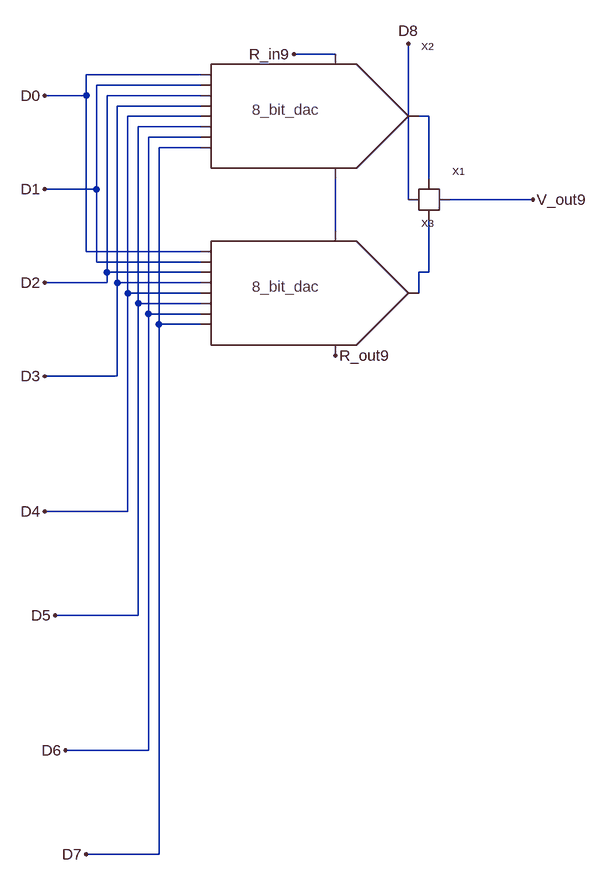
[diagram p0: schematic 9_bit_dac.asc]
9_bit_dac.asc, the LTspice schematic file:
Version 4
SHEET 1 880 1372
WIRE 96 80 32 80
WIRE -112 112 -288 112
WIRE -112 128 -272 128
WIRE -288 144 -288 112
WIRE -288 144 -352 144
WIRE -112 144 -256 144
WIRE -112 160 -240 160
WIRE -112 176 -224 176
WIRE 240 176 224 176
WIRE -112 192 -208 192
WIRE -112 208 -192 208
WIRE -112 224 -176 224
WIRE 240 272 240 176
WIRE -272 288 -272 128
WIRE -272 288 -352 288
WIRE 208 304 208 64
WIRE 400 304 272 304
WIRE 96 352 96 272
WIRE -288 384 -288 144
WIRE -112 384 -288 384
WIRE -272 400 -272 288
WIRE -112 400 -272 400
WIRE -256 416 -256 144
WIRE -112 416 -256 416
WIRE 240 416 240 336
WIRE 240 416 224 416
WIRE -256 432 -256 416
WIRE -256 432 -352 432
WIRE -240 432 -240 160
WIRE -112 432 -240 432
WIRE -224 448 -224 176
WIRE -112 448 -224 448
WIRE 224 448 224 416
WIRE -208 464 -208 192
WIRE -112 464 -208 464
WIRE -192 480 -192 208
WIRE -112 480 -192 480
WIRE -176 496 -176 224
WIRE -112 496 -176 496
WIRE -240 576 -240 432
WIRE -240 576 -352 576
WIRE -224 784 -224 448
WIRE -224 784 -352 784
WIRE -208 944 -208 464
WIRE -208 944 -336 944
WIRE -192 1152 -192 480
WIRE -192 1152 -320 1152
WIRE -176 1312 -176 496
WIRE -176 1312 -288 1312
FLAG 400 304 V_out9
FLAG -352 144 D0
FLAG -352 288 D1
FLAG -352 432 D2
FLAG -352 576 D3
FLAG -352 784 D4
FLAG -336 944 D5
FLAG -320 1152 D6
FLAG -288 1312 D7
FLAG 208 64 D8
FLAG 32 80 R_in9
FLAG 96 544 R_out9
SYMBOL switch 240 304 R0
SYMATTR InstName X1
SYMBOL 8_bit_dac -16 176 R0
SYMATTR InstName X2
SYMBOL 8_bit_dac -16 448 R0
SYMATTR InstName X3

The netlist it stands for:
* 9_bit_dac.asc
XX1 D8 N001 N003 V_out9 switch  ; pins digital_input Vin_1 Vin_2 Vout
XX2 D0 D1 D2 D3 D4 D5 D6 D7 R_in9 N002 N001 8_bit_dac  ; pins D0 D1 D2 D3 D4 D5 D6 D7 R_in8 R_out8 V_out8
XX3 D0 D1 D2 D3 D4 D5 D6 D7 N002 R_out9 N003 8_bit_dac  ; pins D0 D1 D2 D3 D4 D5 D6 D7 R_in8 R_out8 V_out8
.backanno
.end